# EAGLE design AnyFC_Final (EAGLE 6.5.0)
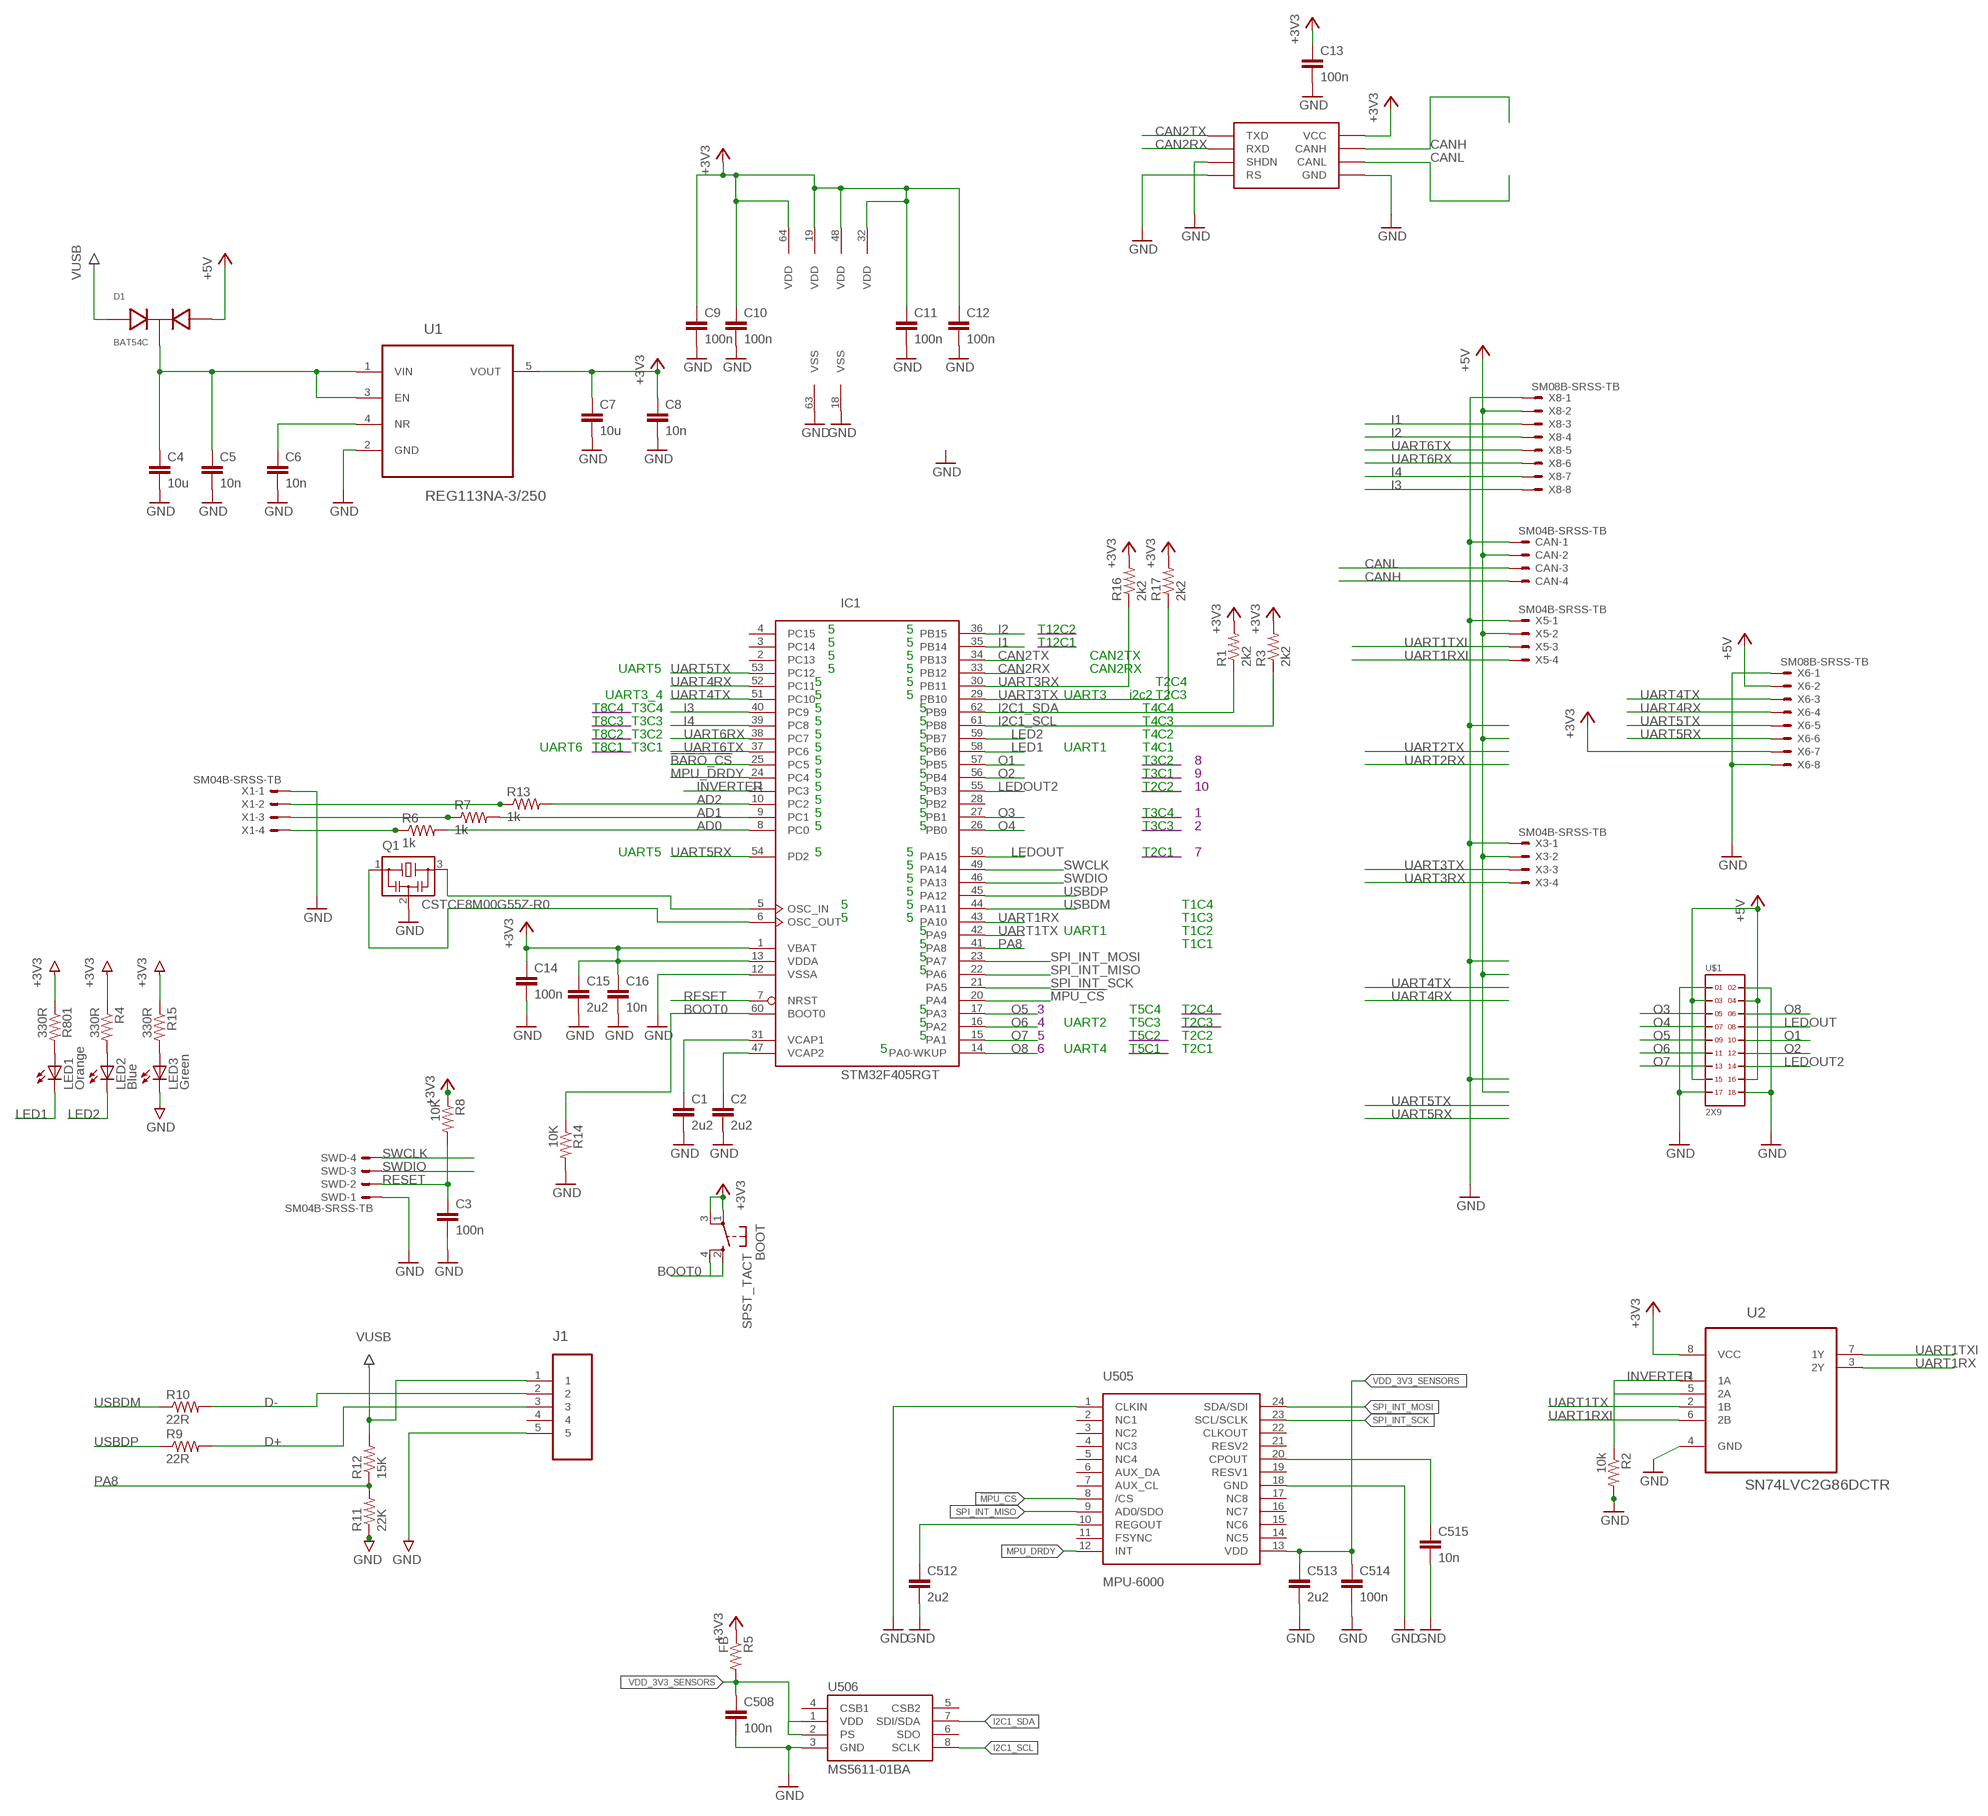
[diagram p0: schematic, sheet 1]

## Parts
BOOT  SPST_TACT  [EVQ-PU]
C1  2u2  CAP0603  [0603-CAP]
C2  2u2  CAP0603  [0603-CAP]
C3  100n  CAP0402  [0402-CAP]
C4  10u  CAP0805  [0805-CAP]
C5  10n  CAP0402  [0402-CAP]
C6  10n  CAP0402  [0402-CAP]
C7  10u  CAP0805  [0805-CAP]
C8  10n  CAP0402  [0402-CAP]
C9  100n  CAP0402  [0402-CAP]
C10  100n  CAP0402  [0402-CAP]
C11  100n  CAP0402  [0402-CAP]
C12  100n  CAP0402  [0402-CAP]
C13  100n  CAP0402  [0402-CAP]
C14  100n  CAP0402  [0402-CAP]
C15  2u2  CAP0603  [0603-CAP]
C16  10n  CAP0402  [0402-CAP]
C508  100n  CAP0402  [0402-CAP]
C512  2u2  CAP0603  [0603-CAP]
C513  2u2  CAP0603  [0603-CAP]
C514  100n  CAP0402  [0402-CAP]
C515  10n  CAP0402  [0402-CAP]
CAN  SM04B-SRSS-TB  [SM04B-SRSS-TB]
D1  BAT54C  [SOT23]
IC1  STM32F405RGT  [LQFP64]
J1  47346-0001  [MOLEX_47346-0001]
LED1  Orange  LEDCHIPLED_0603  [CHIPLED_0603]
LED2  Blue  LEDCHIPLED_0603  [CHIPLED_0603]
LED3  Green  LEDCHIPLED_0603  [CHIPLED_0603]
Q1  CSTCE8M00G55Z-R0  CSTCR6M00G53Z  [CSTER12M]
R1  2k2  RESISTOR0402-RES  [0402-RES]
R2  10k  RESISTOR0402-RES  [0402-RES]
R3  2k2  RESISTOR0402-RES  [0402-RES]
R4  330R  RESISTOR0402-RES  [0402-RES]
R5  FB  RESISTOR0603-RES  [0603-RES]
R6  1k  RESISTOR0402-RES  [0402-RES]
R7  1k  RESISTOR0402-RES  [0402-RES]
R8  10K  RESISTOR0402-RES  [0402-RES]
R9  22R  RESISTOR0402-RES  [0402-RES]
R10  22R  RESISTOR0402-RES  [0402-RES]
R11  22K  RESISTOR0402-RES  [0402-RES]
R12  15K  RESISTOR0402-RES  [0402-RES]
R13  1k  RESISTOR0402-RES  [0402-RES]
R14  10K  RESISTOR0402-RES  [0402-RES]
R15  330R  RESISTOR0402-RES  [0402-RES]
R16  2k2  RESISTOR0402-RES  [0402-RES]
R17  2k2  RESISTOR0402-RES  [0402-RES]
R801  330R  RESISTOR0402-RES  [0402-RES]
SWD  SM04B-SRSS-TB  [SM04B-SRSS-TB]
U1  REG113NA-3/250  [SOT95P280X145-5N]
U2  SN74LVC2G86DCTR  [SOP65P400X130-8N]
U3  MAX3051EKA  [SOT23-8L]
U505  MPU-6000  [QFN-24]
U506  MS5611-01BA  [MS5611-01BA]
U$1  2X9  [2X9]
X1  SM04B-SRSS-TB  [SM04B-SRSS-TB]
X3  SM04B-SRSS-TB  [SM04B-SRSS-TB]
X5  SM04B-SRSS-TB  [SM04B-SRSS-TB]
X6  SM08B-SRSS-TB  [SM08B-SRSS-TB]
X8  SM08B-SRSS-TB  [SM08B-SRSS-TB]

## Nets
!BARO_CS: IC1.25(PC5)
!MPU_CS: IC1.20(PA4) U505.8(/CS)
+3V3: BOOT.1(P) BOOT.3(P1) C7.P$1 C8.P$1 C9.P$1 C10.P$1 C11.P$1 C12.P$1 C13.P$1 C14.P$1 C15.P$1 C16.P$1 IC1.1(VBAT) IC1.13(VDDA) IC1.19(VDD) IC1.32(VDD) IC1.48(VDD) IC1.64(VDD) R1.P$2 R3.P$2 R4.P$1 R5.1 R8.P$1 R15.P$1 R16.P$2 R17.P$2 R801.P$1 U1.5(VOUT) U2.8(VCC) U3.3(VCC) X6.7
+5V: CAN.2 D1.2 U$1.3 U$1.4 U$1.15 U$1.16 X3.2 X5.2 X6.2 X8.2
AD0: IC1.8(PC0) R6.P$2
AD1: IC1.9(PC1) R7.P$2
AD2: IC1.10(PC2) R13.P$2
BOOT0: BOOT.2(S) BOOT.4(S1) IC1.60(BOOT0) R14.P$1
CAN2RX: IC1.33(PB12) U3.4(RXD)
CAN2TX: IC1.34(PB13) U3.1(TXD)
CANH: CAN.4 U3.7(CANH)
CANL: CAN.3 U3.6(CANL)
D+: J1.3 R9.P$2
D-: J1.2 R10.P$2
GND [power]: C1.P$2 C2.P$2 C3.P$2 C4.P$2 C5.P$2 C6.P$2 C7.P$2 C8.P$2 C9.P$2 C10.P$2 C11.P$2 C12.P$2 C13.P$2 C14.P$2 C15.P$2 C16.P$2 C508.P$2 C512.P$2 C513.P$2 C514.P$2 C515.P$2 CAN.1 IC1.12(VSSA) IC1.18(VSS) IC1.63(VSS) J1.5 LED3.C Q1.2 R2.P$2 R11.P$1 R14.P$2 SWD.1 U1.2(GND) U2.4(GND) U3.2(GND) U3.5(SHDN) U3.8(RS) U505.1(CLKIN) U505.18(GND) U506.3(GND) U$1.1 U$1.2 U$1.17 U$1.18 X1.1 X3.1 X5.1 X6.1 X6.8 X8.1
I1: IC1.35(PB14) X8.3
I2: IC1.36(PB15) X8.4
I2C1_SCL: IC1.61(PB8) R3.P$1 U506.8(SCLK)
I2C1_SDA: IC1.62(PB9) R1.P$1 U506.7(SDI/SDA)
I3: IC1.40(PC9) X8.8
I4: IC1.39(PC8) X8.7
INVERTER: IC1.11(PC3) R2.P$1 U2.1(1A) U2.5(2A)
LED1: IC1.58(PB6) LED1.C
LED2: IC1.59(PB7) LED2.C
LEDOUT: IC1.50(PA15) U$1.8
LEDOUT2: IC1.55(PB3) U$1.14
MPU_DRDY [power]: IC1.24(PC4) U505.12(INT)
N$1: C6.P$1 U1.4(NR)
N$2: IC1.5(OSC_IN) Q1.3
N$3: C1.P$1 IC1.31(VCAP1)
N$4: C2.P$1 IC1.47(VCAP2)
N$5: IC1.6(OSC_OUT) Q1.1
N$6: LED1.A R801.P$2
N$7: LED3.A R15.P$2
N$8: LED2.A R4.P$2
N$15: R6.P$1 X1.4
N$16: R7.P$1 X1.3
N$17: R13.P$1 X1.2
N$50: C512.P$1 U505.10(REGOUT)
N$51: C515.P$1 U505.20(CPOUT)
O1: IC1.57(PB5) U$1.10
O2: IC1.56(PB4) U$1.12
O3: IC1.27(PB1) U$1.5
O4: IC1.26(PB0) U$1.7
O5: IC1.17(PA3) U$1.9
O6: IC1.16(PA2) U$1.11
O7: IC1.15(PA1) U$1.13
O8: IC1.14(PA0-WKUP) U$1.6
PA8: IC1.41(PA8) R11.P$2 R12.P$1
RESET: C3.P$1 IC1.7(NRST) R8.P$2 SWD.2
SPI_INT_MISO: IC1.22(PA6) U505.9(AD0/SDO)
SPI_INT_MOSI: IC1.23(PA7) U505.24(SDA/SDI)
SPI_INT_SCK: IC1.21(PA5) U505.23(SCL/SCLK)
SWCLK: IC1.49(PA14) SWD.4
SWDIO: IC1.46(PA13) SWD.3
UART1RX: IC1.43(PA10) U2.3(2Y)
UART1RXI: U2.6(2B) X5.4
UART1TX: IC1.42(PA9) U2.2(1B)
UART1TXI: U2.7(1Y) X5.3
UART3RX: IC1.30(PB11) R16.P$1 X3.4
UART3TX: IC1.29(PB10) R17.P$1 X3.3
UART4RX: IC1.52(PC11) X6.4
UART4TX: IC1.51(PC10) X6.3
UART5RX: IC1.54(PD2) X6.6
UART5TX: IC1.53(PC12) X6.5
UART6RX: IC1.38(PC7) X8.6
UART6TX: IC1.37(PC6) X8.5
USBDM: IC1.44(PA11) R10.P$1
USBDP: IC1.45(PA12) R9.P$1
V5: C4.P$1 C5.P$1 D1.3 U1.1(VIN) U1.3(EN)
VDD_3V3_SENSORS [power]: C508.P$1 C513.P$1 C514.P$1 R5.2 U505.13(VDD) U506.1(VDD) U506.2(PS)
VUSB: D1.1 J1.1 R12.P$2
Unconnected: IC1.2(PC13) IC1.3(PC14) IC1.4(PC15) IC1.28(PB2) J1.4 U505.2(NC1) U505.3(NC2) U505.4(NC3) U505.5(NC4) U505.6(AUX_DA) U505.7(AUX_CL) U505.11(FSYNC) U505.14(NC5) U505.15(NC6) U505.16(NC7) U505.17(NC8) U505.19(RESV1) U505.21(RESV2) U505.22(CLKOUT) U506.4(CSB1) U506.5(CSB2) U506.6(SDO)

## Notes on the sheet
- 5 | 5 | T12C2
- 5 | 5 | T12C1
- 5 | 5 | CAN2TX
- UART5 | 5 | 5 | CAN2RX
- 5 | 5 | T2C4
- UART3_4 | 5 | 5 | UART3 | i2c2 | T2C3
- T8C4 | T3C4 | 5 | 5 | T4C4
- T8C3 | T3C3 | 5 | 5 | T4C3
- T8C2 | T3C2 | 5 | 5 | T4C2
- UART6 | T8C1 | T3C1 | 5 | 5 | UART1 | T4C1
- 5 | 5 | T3C2 | 8
- 5 | 5 | T3C1 | 9
- 5 | 5 | T2C2 | 10
- 5 | 5
- 5 | 5 | T3C4 | 1
- 5 | 5 | T3C3 | 2
- UART5 | 5 | 5 | T2C1 | 7
- 5
- 5
- 5
- 5 | 5 | T1C4
- 5 | 5 | T1C3
- 5 | UART1 | T1C2
- 5 | T1C1
- 5
- 5
- 5 | 3 | T5C4 | T2C4
- 5 | 4 | UART2 | T5C3 | T2C3
- 5 | 5 | T5C2 | T2C2
- 5 | 6 | UART4 | T5C1 | T2C1

## Library data of the parts
BOOT = omat:SPST_TACT: SMT 6mm switch, EVQQ2 series http://www.ladyada.net/library/eagle
C1-C16 C512 C513 = pixhawk2:CAP: Capacitor Standard 0603 ceramic capacitor, and 0.1" leaded capacitor.; PARTNO: C1608X6S1C225K080AC
C508 C514 = pixhawk2:CAP: Capacitor Standard 0603 ceramic capacitor, and 0.1" leaded capacitor.; PARTNO: CC0402ZRY5V7BB104
C515 = pixhawk2:CAP: Capacitor Standard 0603 ceramic capacitor, and 0.1" leaded capacitor.; PARTNO: 06033C103JAT2A
CAN SWD X1 X3 X5 = con-jst2:?M04B-SRSS-TB: Disconnectable Crimp style connector, 1.0mm pitch 4 contacts
D1 = zik:BAT54C: Dual schottky diode
IC1 = micro-stm_v2:STM32F405R*T: ARM 32-bit Cortex™-M3 CPU 168 MHz maximum frequency 1024 Kbytes of Flash memory 192 kbytes of SRAM 51 GPIOs 1.8 to 3.6 V application supply
J1 = Molex-47346-0001:47346-0001: CONN RCPT 5POS MICRO USB R/A SMD; MPN: 47346-0001; OC_FARNELL: 1568026; OC_NEWARK: 47M0505; PACKAGE: 5 POS MICRO USB R/A; SUPPLIER: MOLEX
LED1-LED3 = led:LED: LED OSRAM: - CHIPLED LG R971, LG N971, LY N971, LG Q971, LY Q971, LO R971, LY R971 LH N974, LH R974 LS Q976, LO Q976, LY Q976 LO Q996 - Hyper CHIPLED LW Q18S LB Q993, LB Q99A, LB R99A - SideLED LS A670, LO A670, LY A670, LG A670, LP A670 LB A673, LV A673, LT A673, LW A673 LH A674 LY A675 LS A676, LA A676, LO A676, LY A676, LW A676 LS A679, LY A679, LG A679 - Hyper Micro SIDELED® LS Y876, LA Y876, LO Y876, LY Y876 LT Y87S - SmartLED LW L88C, LW L88S LB L89C, LB L89S, LG L890 LS L89K, LO L89K, LY L89K LS L896, LA L896, LO L896, LY L896 - TOPLED LS T670, LO T670, LY T670, LG T670, LP T670 LSG T670, LSP T670, LSY T670, LOP T670, LYG T670 LG T671, LOG T671, LSG T671 LB T673, LV T673, LT T673, LW T673 LH T674 LS T676, LA T676, LO T676, LY T676, LB T676, LH T676, LSB T676, LW T676 LB T67C, LV T67C, LT T67C, LS T67K, LO T67K, LY T67K, LW E67C LS E67B, LA E67B, LO E67B, LY E67B, LB E67C, LV E67C, LT E67C LW T67C LS T679, LY T679, LG T679 LS T770, LO T770, LY T770, LG T770, LP T770 LB T773, LV T773, LT T773, LW T773 LH T774 LS E675, LA E675, LY E675, LS T675 LS T776, LA T776, LO T776, LY T776, LB T776 LHGB T686 LT T68C, LB T68C - Hyper Mini TOPLED® LB M676 - Mini TOPLED Santana® LG M470 LS M47K, LO M47K, LY M47K Source: http://www.osram.convergy.de LUXEON: - LUMILED® LXK2-PW12-R00, LXK2-PW12-S00, LXK2-PW14-U00, LXK2-PW14-V00 LXK2-PM12-R00, LXK2-PM12-S00, LXK2-PM14-U00 LXK2-PE12-Q00, LXK2-PE12-R00, LXK2-PE12-S00, LXK2-PE14-T00, LXK2-PE14-U00 LXK2-PB12-K00, LXK2-PB12-L00, LXK2-PB12-M00, LXK2-PB14-N00, LXK2-PB14-P00, LXK2-PB14-Q00 LXK2-PR12-L00, LXK2-PR12-M00, LXK2-PR14-Q00, LXK2-PR14-R00 LXK2-PD12-Q00, LXK2-PD12-R00, LXK2-PD12-S00 LXK2-PH12-R00, LXK2-PH12-S00 LXK2-PL12-P00, LXK2-PL12-Q00, LXK2-PL12-R00 Source: www.luxeon.com KINGBRIGHT: KA-3528ASYC Source: www.kingbright.com
Q1 = cstce-resonator:CSTCR: Resonator Source: murata.co.jp; MPN: CSTCC12M0; OC_FARNELL: 1170434; OC_NEWARK: 25M8759
R1-R17 R801 = pixhawk2:RESISTOR: Resistor Basic schematic elements and footprints for 0603, 1206, and PTH 1/10th watt (small) resistors.; PARTNO: RC0402FR-0710KL
U1 = REG113NA:REG113NA-3/250: DMOS 400mA Low-Dropout Regulator; MPN: REG113NA-3/250; OC_FARNELL: 1575540; OC_NEWARK: 75C7591; PACKAGE: SOT-23-5; SUPPLIER: Texas Instruments
U2 = SN74LVC2G86DCTR:SN74LVC2G86DCTR: DUAL 2-INPUT EXCLUSIVE-OR GATE,SSOP-8; MPN: SN74LVC2G86DCTR; OC_FARNELL: 2334919; OC_NEWARK: 94T5059; PACKAGE: SSOP-8; SUPPLIER: TEXAS INSTRUMENTS
U3 = maxim:MAX3051
U505 = pixhawk2:MPU-6000: Invensense MPU-6000: 3-axis gyro, 3-axis accel & 9-axis MotionFusion The MPU-60X0 Motion Processing Unit (MPU?) is the world?s first motion processing solution with integrated 9-axis sensor fusion for handset and tablet applications, game controllers, motion pointer remote controls, and other consumer devices. The MPU-60X0 has an embedded 3-axis MEMS gyroscope, 3-axis MEMS accelerometer and Digital Motion Processor? (DMP) hardware accelerator engine with an auxiliary I 2 C port that interfaces to third party digital sensors, such as magnetometers. Interfacing with a 3-axis magnetometer delivers a complete 9-axis sensor fusion output to the MPU?s primary I 2 C or SPI port. (SPI is available on MPU-6000 only). This combines acceleration and rotational motion plus heading information into a single data stream for the application; DATASHEET: http://invensense.com/mems/gyro/documents/PS-MPU-6000A-00_v1.0.pdf; LINK: http://invensense.com/mems/gyro/mpu6000.html; MFGPN: MPU-6000; PARTNO: MPU-6000
U506 = pixhawk2:MS5611-01BA: MS5611-01BA The MS5611-01BA is a new generation of high resolution altimeter sensors from MEAS Switzerland with SPI and I 2 C bus interface. It is optimized for altimeters and variometers with an altitude resolution of 10 cm. The sensor module includes a high linearity pressure sensor and an ultra low power 24 bit ?? ADC with internal factory calibrated coefficients. It provides a precise digital 24 Bit pressure and temperature value and different operation modes that allow the user to optimize for conversion speed and current consumption. A high resolution temperature output allows the implementation of an altimeter/thermometer function without any additional sensor. The MS5611-01BA can be interfaced to virtually any microcontroller. The communication protocol is simple, without the need of programming internal registers in the device. Small dimensions of only 5.0 mm x 3.0 mm and a height of 1.7 mm allow for integration in mobile devices. This new sensor module generation is based on leading MEMS technology and latest benefits from MEAS Switzerland proven experience and know-how in high volume manufacturing of altimeter modules, which have been widely used for over a decade. The sensing principle employed leads to very low hysteresis and high stability of both pressure and temperature signal. High resolution module, 10 cm Fast conversion down to 1 ms Low power, 1 µA (standby < 0.15 µA) QFN package 5.0 x 3.0 x 1.7 mm3 Supply voltage 1.8 to 3.6 V Integrated digital pressure sensor (24 bit ?? ADC) Operating range: 10 to 1200 mbar, -40 to +85 °C I2C and SPI interface up to 20 MHz No external components (Internal oscillator) Excellent long term stability; DATASHEET: http://www.meas-spec.com/downloads/MS5611-01BA01.pdf; LINK: http://www.meas-spec.com/product/t_product.aspx?id=8503#; MFGPN: MS5611-01BA; PARTNO: MS5611-01BA
U$1 = headers.edge(.1in):2X9
X6 X8 = con-jst2:?M08B-SRSS-TB: Disconnectable Crimp style connector, 1.0mm pitch 8 contacts

## Net classes
1 power: width 0.15 mm, drill 0.2 mm, clearance 0.152 mm

## Board
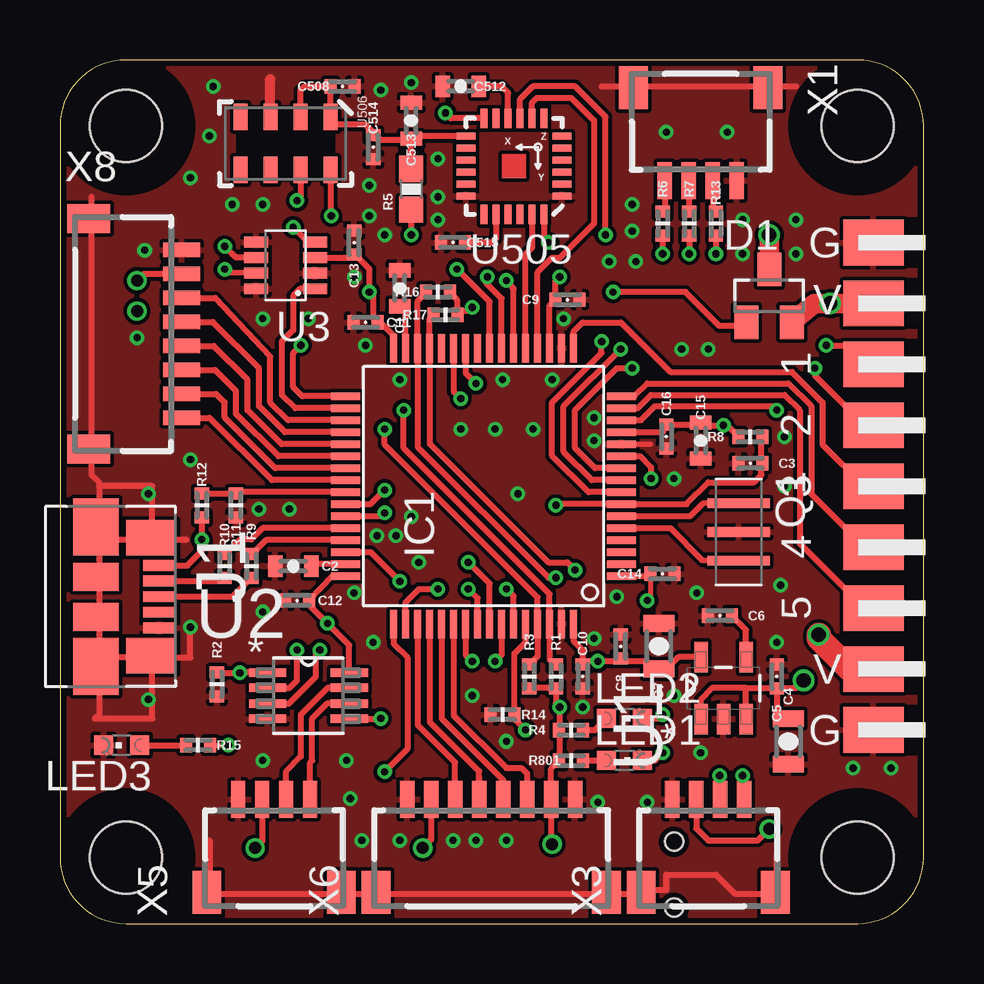
[diagram p1: board, top side]
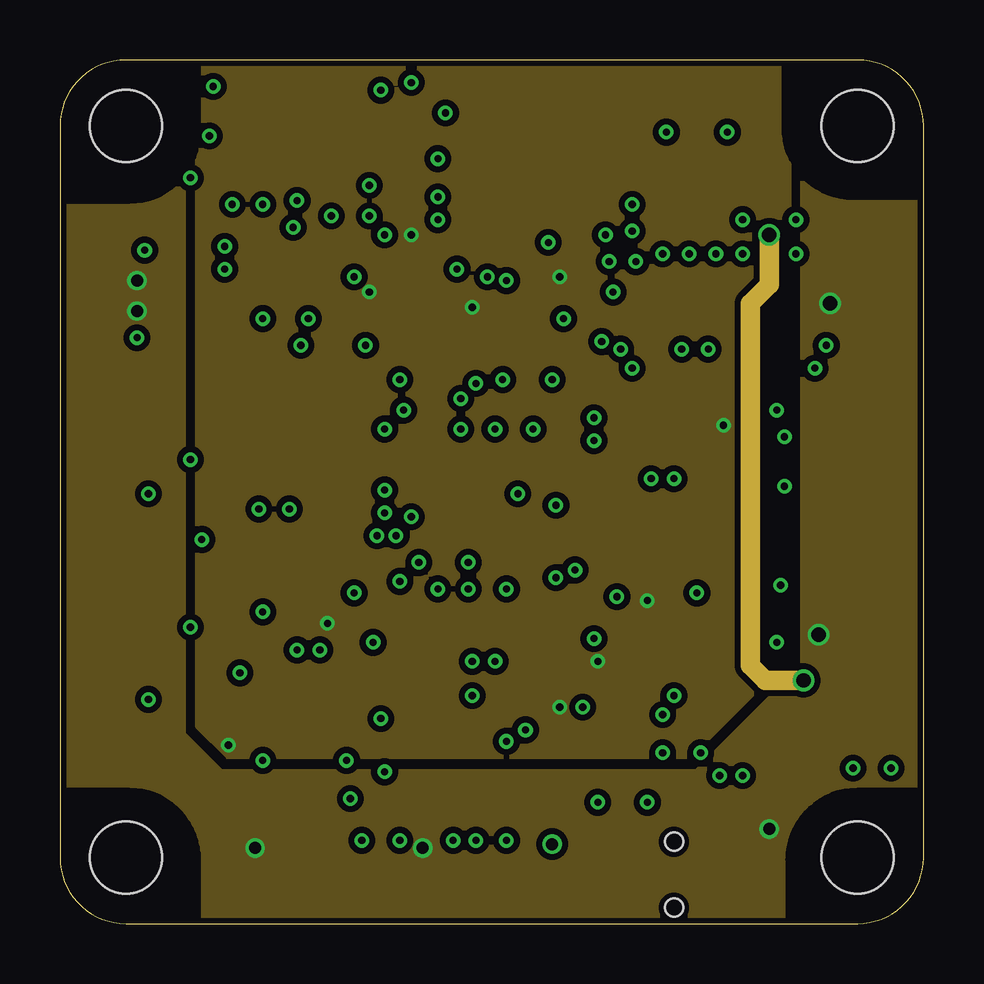
[diagram p2: board, inner layer Route2]
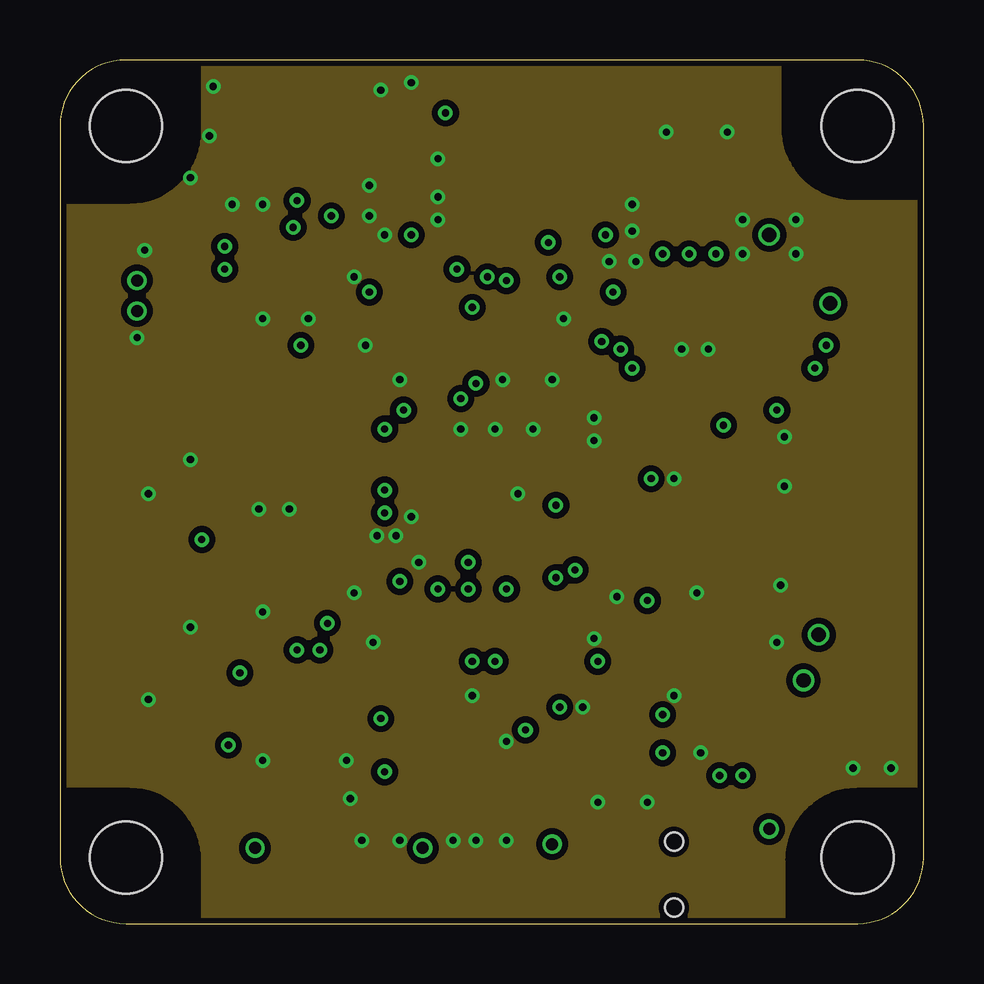
[diagram p3: board, inner layer Route15]
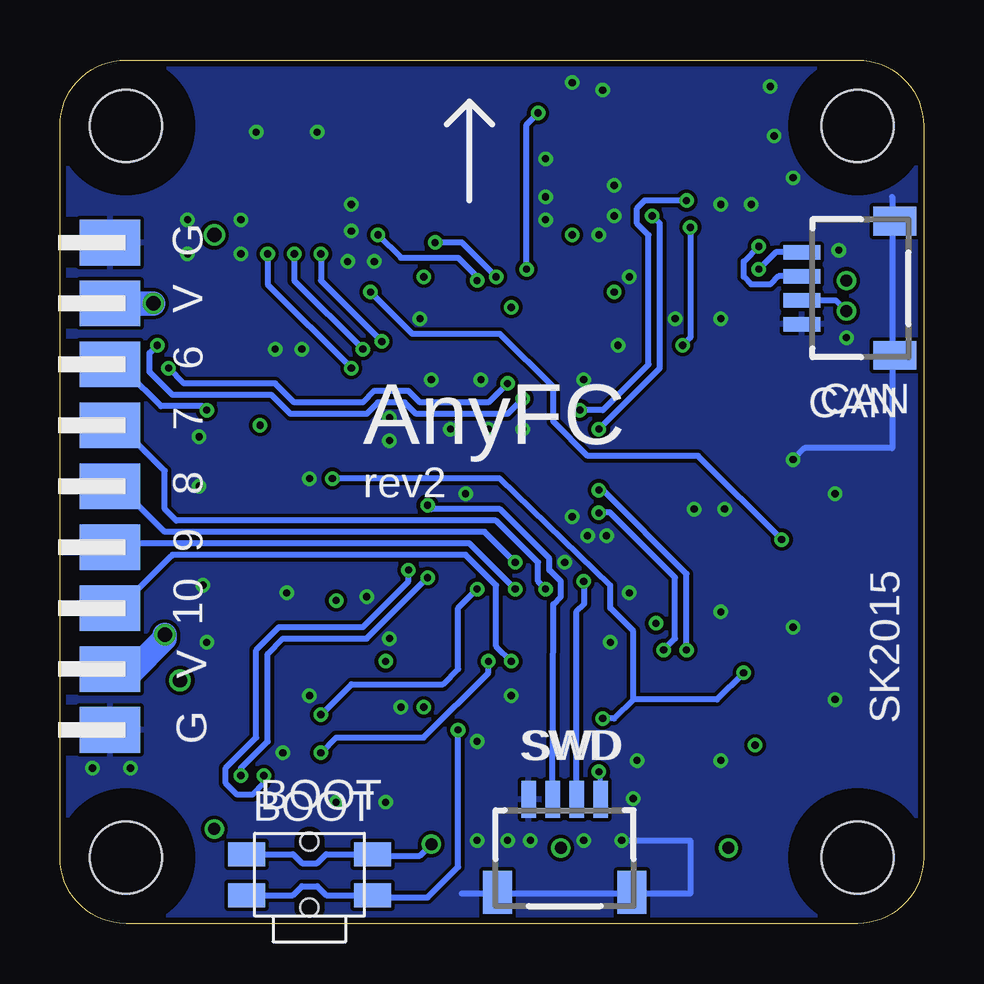
[diagram p4: board, bottom side, seen from below]

Size 36 x 36 mm. Coordinates in mm from the lower left corner, seen from the top.
Outline: 0,2.75 arc90 2.75,0 33.25,0 arc90 36,2.75 36,33.25 arc90 33.25,36 2.75,36 arc90 0,33.25 0,2.75
Copper layers (1*2*15*16): Top 0.035mm / dielectric 0.2mm / Route2 0.0175mm / dielectric 1.1mm / Route15 0.0175mm / dielectric 0.2mm / Bottom 0.035mm
Design rules "SeeedStudio_DRU_no_angle_20130527 *": minimum track width 6mil, minimum drill 10mil, track to track 6mil, track to pad 6mil, pad to pad 6mil, via to via 6mil, smd to smd 0mil, copper to edge 10mil, drill to drill 10mil, minimum pad ring 6mil, minimum via ring 6mil, stop-mask expansion 2mil, vias tented up to drill 25mil, thermal gap 6mil
Holes 3 mm at 2.75,2.75 2.75,33.25 33.25,33.25 33.25,2.75
tRestrict: area 0,0 to 5.5,5.5; area 30.5,0 to 36,5.5; area 30.5,30.5 to 36,36; area 0,30.5 to 5.5,36; area 7.3,30.9 to 11.5,34.1
bRestrict: area 0,30.5 to 5.5,36; area 30.5,30.5 to 36,36; area 30.5,0 to 36,5.5; area 0,0 to 5.5,5.5

### Footprints (pad centres in the part's own frame; a part is rotated, then mirrored left to right if it is on the bottom)
EVQ-PU = smd 1.55 x 1: 1 2.625,0.85; 2 2.625,-0.85; 3 -2.625,0.85; 4 -2.625,-0.85 | hole 0.75: 0,-1.375; 0,1.375
0603-CAP = smd 0.6 x 0.9: P$1 -0.75,0; P$2 0.75,0
0402-CAP = smd 0.5 x 0.6: P$1 -0.5,0; P$2 0.5,0
0805-CAP = smd 0.7 x 1.3: P$1 -0.95,0; P$2 0.95,0
SM04B-SRSS-TB = smd 0.6 x 1.55: 1 -1.5,2.975; 2 -0.5,2.975; 3 0.5,2.975; 4 1.5,2.975 | smd 1.2 x 1.8: FIT@1 -2.8,-0.9; FIT@2 2.8,-0.9
SOT23 = smd 1 x 1.4: 1 -0.95,-1.1; 2 0.95,-1.1; 3 0,1.1
LQFP64 = smd 0.3 x 1.2: 1 -3.75,-5.75; 2 -3.25,-5.75; 3 -2.75,-5.75; 4 -2.25,-5.75; 5 -1.75,-5.75; 6 -1.25,-5.75; 7 -0.75,-5.75; 8 -0.25,-5.75; 9 0.25,-5.75; 10 0.75,-5.75; 11 1.25,-5.75; 12 1.75,-5.75; 13 2.25,-5.75; 14 2.75,-5.75; 15 3.25,-5.75; 16 3.75,-5.75; 33 3.75,5.75; 34 3.25,5.75; 35 2.75,5.75; 36 2.25,5.75; 37 1.75,5.75; 38 1.25,5.75; 39 0.75,5.75; 40 0.25,5.75; 41 -0.25,5.75; 42 -0.75,5.75; 43 -1.25,5.75; 44 -1.75,5.75; 45 -2.25,5.75; 46 -2.75,5.75; 47 -3.25,5.75; 48 -3.75,5.75 | smd 1.2 x 0.3: 17 5.75,-3.75; 18 5.75,-3.25; 19 5.75,-2.75; 20 5.75,-2.25; 21 5.75,-1.75; 22 5.75,-1.25; 23 5.75,-0.75; 24 5.75,-0.25; 25 5.75,0.25; 26 5.75,0.75; 27 5.75,1.25; 28 5.75,1.75; 29 5.75,2.25; 30 5.75,2.75; 31 5.75,3.25; 32 5.75,3.75; 49 -5.75,3.75; 50 -5.75,3.25; 51 -5.75,2.75; 52 -5.75,2.25; 53 -5.75,1.75; 54 -5.75,1.25; 55 -5.75,0.75; 56 -5.75,0.25; 57 -5.75,-0.25; 58 -5.75,-0.75; 59 -5.75,-1.25; 60 -5.75,-1.75; 61 -5.75,-2.25; 62 -5.75,-2.75; 63 -5.75,-3.25; 64 -5.75,-3.75
MOLEX_47346-0001 = smd 0.45 x 1.38: 1 -1.3,0; 2 -0.65,0; 3 0,0; 4 0.65,0; 5 1.3,0 | smd 1.475 x 2.1: M1 -2.462,-0.36; M2 2.462,-0.36 | smd 2.375 x 1.9: M3 -2.913,-2.66; M6 2.913,-2.66 | smd 1.175 x 1.9: M4 -0.82,-2.66; M5 0.85,-2.66
CHIPLED_0603 = smd 0.8 x 0.8: A 0,-0.75; C 0,0.75
CSTER12M = smd 0.4 x 2.6: 1 -1.2,0; 2 0,0; 3 1.2,0
0402-RES = smd 0.5 x 0.6: P$1 -0.5,0; P$2 0.5,0
0603-RES = smd 1.1 x 1: 1 -0.85,0; 2 0.85,0
SOT95P280X145-5N = smd 1.27 x 0.559: 1 -1.295,0.94; 2 -1.295,0; 3 -1.295,-0.94; 4 1.295,-0.94; 5 1.295,0.94
SOP65P400X130-8N = smd 1.549 x 0.356: 1 -1.702,0.965; 2 -1.702,0.33; 3 -1.702,-0.33; 4 -1.702,-0.965; 5 1.702,-0.965; 6 1.702,-0.33; 7 1.702,0.33; 8 1.702,0.965
SOT23-8L = smd 0.45 x 1: 1 -0.975,-1.225; 2 -0.325,-1.225; 3 0.325,-1.225; 4 0.975,-1.225; 5 0.975,1.225; 6 0.325,1.225; 7 -0.325,1.225; 8 -0.975,1.225
QFN-24 = smd 0.8 x 0.29: 1 -2,1.25; 2 -2,0.75; 3 -2,0.25; 4 -2,-0.25; 5 -2,-0.75; 6 -2,-1.25; 13 2,-1.25; 14 2,-0.75; 15 2,-0.25; 16 2,0.25; 17 2,0.75; 18 2,1.25 | smd 0.29 x 0.8: 7 -1.25,-2; 8 -0.75,-2; 9 -0.25,-2; 10 0.25,-2; 11 0.75,-2; 12 1.25,-2; 19 1.25,2; 20 0.75,2; 21 0.25,2; 22 -0.25,2; 23 -0.75,2; 24 -1.25,2
MS5611-01BA = smd 1.1 x 0.6: 1 -1.1,1.875; 2 -1.1,0.625; 3 -1.1,-0.625; 4 -1.1,-1.875; 5 1.1,-1.875; 6 1.1,-0.625; 7 1.1,0.625; 8 1.1,1.875
2X9 = smd 1.905 x 2.54: 1 0,-2.159; 3 2.54,-2.159; 5 5.08,-2.159; 7 7.62,-2.159; 9 10.16,-2.159; 11 12.7,-2.159; 13 15.24,-2.159; 15 17.78,-2.159; 17 20.32,-2.159 | smd 1.905 x 2.54 bottom: 2 0,-2.159; 4 2.54,-2.159; 6 5.08,-2.159; 8 7.62,-2.159; 10 10.16,-2.159; 12 12.7,-2.159; 14 15.24,-2.159; 16 17.78,-2.159; 18 20.32,-2.159
SM08B-SRSS-TB = smd 0.6 x 1.55: 1 -3.5,2.975; 2 -2.5,2.975; 3 -1.5,2.975; 4 -0.5,2.975; 5 0.5,2.975; 6 1.5,2.975; 7 2.5,2.975; 8 3.5,2.975 | smd 1.2 x 1.8: FIT@1 -4.8,-0.9; FIT@2 4.8,-0.9

### Placement (x,y rotation side)
BOOT  25.6,2.04 0 bottom
C1  14.17,26.48 90 top
C2  9.72,14.9 180 top
C3  28.77,19.18 180 top
C4  30.36,7.59 270 top
C5  29.88,10.29 90 top
C6  27.5,12.83 180 top
C7  24.96,11.56 90 top
C8  23.38,11.56 90 top
C9  21.15,26.01 0 top
C10  21.79,10.29 270 top
C11  12.74,25.06 180 top
C12  9.88,13.47 180 top
C13  12.26,28.39 90 top
C14  25.12,14.58 0 top
C15  26.71,20.13 270 top
C16  25.28,20.29 270 top
C508  11.79,34.9 0 top
C512  16.71,34.9 180 top
C513  14.64,33.47 90 top
C514  13.06,32.36 270 top
C515  16.39,28.39 180 top
CAN  2.1,26.48 90 bottom
D1  29.57,26.17 0 top
IC1  17.66,18.23 90 top
J1  4.17,13.63 270 top
LED1  23.53,6.8 270 top
LED2  23.53,8.55 270 top
LED3  2.58,7.44 90 top
Q1  28.3,16.32 270 top
R1  20.68,10.29 270 top
R2  6.55,9.97 270 top
R3  19.56,10.29 270 top
R4  21.31,8.07 0 top
R5  14.64,30.61 90 top
R6  25.12,29.18 270 top
R7  26.23,29.18 270 top
R8  28.77,20.29 0 top
R9  7.98,14.9 270 top
R10  6.87,14.9 270 top
R11  7.34,17.44 90 top
R12  5.91,17.44 270 top
R13  27.34,29.18 270 top
R14  18.45,8.71 180 top
R15  5.75,7.44 180 top
R16  15.75,26.33 0 top
R17  16.07,25.37 0 top
R801  21.31,6.8 0 top
SWD  14.96,2.2 0 bottom
U1  27.66,9.82 90 top
U2  10.36,9.5 0 top
U3  9.4,27.44 90 top
U505  18.93,31.56 180 top
U506  9.4,32.52 270 top
U$1  36.08,28.39 270 top
X1  26.71,33.95 180 top
X3  27.03,2.2 0 top
X5  8.93,2.2 0 top
X6  17.98,2.2 0 top
X8  2.1,24.58 270 top

### Tracks (layer width: path | path; a pad name or v marks a point on that pad's centre or on a via)
!MPU_CS
  Top 0.254: IC1.20 19.91,27.15 20.52,27.75 20.84,27.75 22.26,29.18 22.26,33.47 21.31,34.42 19.88,34.42 19.68,34.22 U505.8
+3V3  (via drill 0.3, 0.5)
  Top 0.2: R15.P$1 v7.02,7.44 | 24.61,14.48 24.61,13.59 v24.49,13.47 | 10.36,13.49 C12.P$1
  Top 0.254: U3.3 12.25,27.76 12.26,27.91 | 12.26,27.91 12.27,27.77 C13.P$1 | IC1.13 25.12,20.48 C16.P$1 26.78,20.79 C15.P$1 26.75,20.88 26.39,20.93 26.71,20.93 26.71,20.77 v27.66,20.77 27.82,20.77 R8.P$1 | IC1.64 21.41,11.78 21.79,11.4 21.79,10.93 | 21.79,10.93 21.73,10.85 C10.P$1 21.79,10.93 | IC1.1 24.61,14.48 C14.P$1 | 26.71,10.61 U1.5 25.78,11.11 25.28,10.61 C7.P$1 25.1,10.58 24.8,10.61 | C7.P$1 24.8,10.61 | 24.8,10.61 24.49,10.92 24.48,10.92 23.38,10.93 | C8.P$1 23.38,10.93 | 23.38,10.93 v22.42,10.93 21.79,10.93 | IC1.48 11.37,14.48 10.86,13.97 C12.P$1 10.36,13.44 10.36,13.31 v11.15,12.52 12.06,11.61 U2.8 | IC1.32 13.91,24.52 13.37,25.06 13.29,24.97 13.27,24.97 C11.P$1 | IC1.19 20.41,25.77 C9.P$1 20.65,26.78 v20.84,26.96 | 20.79,8.98 v20.84,9.02 | R3.P$2 19.59,9.82 20.36,9.82 R1.P$2 20.68,9.18 v20.84,9.02 | v20.52,3.31 20.48,3.35 X6.7 20.48,6.44 20.84,6.8 | v20.84,9.02 20.84,8.23 20.81,8.25 R4.P$1 20.84,8.05 20.84,6.8 | 20.84,6.8 R801.P$1 | C11.P$1 13.06,25.21 13.06,26.17 v12.9,26.33 12.9,27.28 12.42,27.75 C13.P$1 | 13.19,25.06 C11.P$1 | 12.26,27.91 C13.P$1 | R5.1 v14.64,28.71 | R16.P$2 16.25,26.3 16.55,26.01 16.55,25.4 R17.P$2 16.73,25.53 17.18,25.53 v17.18,25.69
  Bottom 0.254: BOOT.3 26.29,2.89 25.91,2.51 25.28,2.51 24.91,2.89 BOOT.1 22.8,2.89 22.74,2.83 20.99,2.83 v20.52,3.31
  pour Route2 (isolate 0.254): 5.75,38.07 30.36,38.07 30.36,11.09 26.23,6.96 7.02,6.96 5.75,8.23
+5V  (via drill 0.5, 0.6)
  Top 0.254: X8.2 3.49,27.08 v3.21,26.8 | X5.2 8.43,3.44 v8.13,3.15 | X6.2 15.48,3.51 v15.12,3.15 | X3.2 26.53,3.97 27.03,3.47 29.09,3.47 v29.57,3.94
  Top 0.813: U$1.3 v32.11,25.85 31.46,25.85 D1.2
  Top 1.016: U$1.16 32.9,10.61 31.63,11.88 v31.63,12.04
  Bottom 0.254: CAN.2 3.67,25.98 v3.21,25.53
  Bottom 1.016: v31.63,12.04 31.63,11.88 33.06,10.45 U$1.16 | U$1.3 v32.11,25.85
  pour Route2 (isolate 0.254): 30.99,38.07 37.03,38.07 37.19,37.91 37.19,-2.41 36.71,-2.88 -2.82,-2.88 -3.93,-1.77 -3.93,37.76 -3.77,37.91 5.12,37.91 5.12,7.91 6.71,6.32 26.55,6.32 30.99,10.77
AD0  (via drill 0.3)
  Top 0.254: IC1.8 22.04,17.98 20.52,19.5 20.52,21.72 22.58,23.79 v22.58,24.26 | R6.P$2 v25.12,27.91
  Bottom 0.254: v25.12,27.91 25.12,26.8 v22.58,24.26
AD1  (via drill 0.3)
  Top 0.254: IC1.9 22.17,18.48 20.99,19.66 20.99,21.56 v23.38,23.95 | R7.P$2 v26.23,27.91
  Bottom 0.254: v26.23,27.91 26.23,26.8 v23.38,23.95
AD2  (via drill 0.3)
  Top 0.254: IC1.10 22.31,18.98 21.47,19.82 21.47,21.41 23.22,23.15 v23.85,23.15 | R13.P$2 v27.34,27.91
  Bottom 0.254: v27.34,27.91 27.34,26.64 v23.85,23.15
BOOT0  (via drill 0.3)
  Top 0.254: v19.41,8.07 18.95,8.52 R14.P$1 18.93,8.84 18.93,11.24 19.41,11.72 IC1.60
  Bottom 0.254: BOOT.4 26.29,1.19 25.91,1.56 25.28,1.56 24.91,1.19 BOOT.2 22.84,1.19 22.74,1.08 20.68,1.08 19.41,2.35 v19.41,8.07
CAN2RX  (via drill 0.3)
  Top 0.254: IC1.33 10.1,21.98 9.72,22.36 9.72,23.79 v10.04,24.1 | U3.4 10.33,28.41 v9.72,29.02
  Bottom 0.254: v9.72,29.02 9.72,24.42 v10.04,24.1
CAN2TX
  Top 0.254: U3.1 10.02,26.46 9.72,26.17 9.72,24.74 9.25,24.26 9.25,22.04 9.81,21.48 IC1.34
CANH  (via drill 0.3)
  Top 0.254: U3.7 7.02,27.13 v6.87,27.28
  Bottom 0.254: CAN.4 6.16,27.98 v6.87,27.28
CANL  (via drill 0.3)
  Top 0.254: U3.6 7.33,27.76 7.19,27.91 7.18,27.91 v6.87,28.23
  Bottom 0.254: CAN.3 6.05,26.98 6.39,26.64 7.18,26.64 7.5,26.96 7.5,27.6 v6.87,28.23
D+
  Top 0.254: J1.3 7.18,13.63 R9.P$2
D-
  Top 0.254: J1.2 6.75,14.28 R10.P$2
GND  (via drill 0.3)
  Top 0.2: IC1.12 24.62,19.98
  Top 0.254: 1.31,30.29 1.31,18.71 1.63,18.39 1.63,18.23 | 1.63,18.23 1.63,16.01 | 1.63,16.01 3.85,16.01 | 3.85,16.01 3.85,18.23 1.63,18.23 | 1.63,16.01 1.63,11.09 | 1.63,11.09 1.63,8.71 1.47,8.55 3.85,8.55 3.85,11.09 | 3.85,11.09 1.63,11.09 | 3.85,11.09 5.44,11.09 v5.44,12.36 | 6.23,3.47 6.23,1.24 24.49,1.24 24.64,1.4 25.28,1.4 25.28,2.04 27.34,2.04 28.14,1.24 29.88,1.24 29.88,2.83 | 3.85,16.01 5.28,16.01 | 22.58,34.9 30.68,34.9
  Top 0.406: 8.77,35.22 8.77,33.47 8.78,33.47 U506.3
  Bottom 0.254: 1.31,30.29 1.31,19.82 4.96,19.82 v5.44,19.34 | v12.58,3.47 9.72,3.47 9.72,1.24 19.25,1.24
  other vias: 25.6,18.55 18.14,20.61 14.64,16.96 8.45,12.99 9.56,17.28 12.9,29.5 7.18,29.98 25.28,32.99 14.64,35.06 13.37,34.74 5.44,31.09 14.01,16.17 19.09,17.91 23.22,13.63 30.04,14.1 12.26,26.96 8.45,25.21 14.17,22.68 12.74,24.1 13.53,28.71 15.75,29.34 6.39,34.9 6.23,32.84 15.75,31.88 15.75,30.29 12.9,30.77 8.45,29.98 22.9,27.6 24.01,27.6 23.85,28.87 23.85,29.98 28.45,29.34 28.45,27.91 30.68,27.91 30.68,29.34 34.65,6.48 33.06,6.48 17.18,9.5 18.61,7.59 18.61,3.47 16.39,3.47 17.34,3.47 14.17,3.47 22.26,11.88 13.21,16.17 12.26,13.79 19.72,20.61 16.71,20.61 20.99,25.21 21.79,9.02 24.49,5.05 22.42,5.05 12.1,5.21 26.71,7.12 25.6,9.5 30.2,20.29 30.2,18.23 14.96,15.05 22.26,21.09 22.26,20.13 26.55,13.79 29.88,11.72 10.36,25.21 3.53,28.07 3.21,24.42 3.69,17.91 3.69,9.34 11.95,6.8 8.45,6.8 8.29,17.28 27.82,32.99 25.91,23.95 27.03,23.95 18.45,22.68 20.52,22.68 13.06,11.72
  pour Top: -14.57,42.84 -14.57,-10.19 61,-10.19 61,42.84
  pour Bottom: -14.57,42.84 -14.57,-7.96 60.36,-7.96 60.36,42.84
  pour Route15 (isolate 0.254): -7.26,40.14 -7.26,-5.11 42.58,-5.11 42.58,40.14
I1
  Top 0.254: IC1.35 9.51,20.98 8.77,21.72 8.77,23.63 6.48,26.08 X8.3
I2
  Top 0.254: IC1.36 9.38,20.48 8.29,21.56 8.29,23.15 6.37,25.08 X8.4
I2C1_SCL  (via drill 0.3)
  Top 0.254: v13.53,20.61 13.53,19.98 19.91,13.6 IC1.61 19.91,11.14 R3.P$1 | U506.8 11.28,29.63 v11.31,29.5
  Bottom 0.254: v13.53,20.61 10.99,23.15 10.99,29.18 v11.31,29.5
I2C1_SDA  (via drill 0.3)
  Top 0.254: v14.33,21.41 14.33,19.82 20.41,13.73 IC1.62 20.41,11 R1.P$1 | U506.7 10.03,30.29 v9.88,30.14
  Bottom 0.254: v9.88,30.14 11.63,30.14 11.95,29.82 11.95,29.18 11.47,28.71 11.47,23.31 13.37,21.41 v14.33,21.41
I3
  Top 0.254: IC1.40 8.84,18.48 6.24,21.08 X8.8
I4
  Top 0.254: IC1.39 8.97,18.98 6.87,21.09 6.87,21.72 6.51,22.08 X8.7
INVERTER  (via drill 0.3)
  Top 0.254: U2.5 13.2,8.53 13.21,8.55 v13.37,8.55 | U2.1 7.51,10.46 v7.5,10.45 6.55,10.45 R2.P$1 | IC1.11 24.19,19.48 24.64,19.02 v24.64,18.55
  Bottom 0.254: v7.5,10.45 8.61,9.34 12.1,9.34 | 12.1,9.34 12.1,12.2 13.06,13.15 13.06,14.1 17.66,18.55 v24.64,18.55 | 12.1,9.34 12.9,8.55 v13.37,8.55
LED1  (via drill 0.3)
  Top 0.254: IC1.58 18.41,11.2 v18.14,10.93 | LED1.C 24.8,6.8 v25.12,7.12
  Bottom 0.254: v25.12,7.12 24.49,7.75 20.84,7.75 18.14,10.45 v18.14,10.93
LED2  (via drill 0.3)
  Top 0.254: IC1.59 18.91,13.65 v18.61,13.94 | LED2.C 24.96,8.55 v25.12,8.71
  Bottom 0.254: v25.12,8.71 23.85,9.97 20.04,9.97 19.41,10.61 19.41,13.15 v18.61,13.94
LEDOUT  (via drill 0.3)
  Top 0.254: IC1.50 14.41,13.39 14.96,13.94 v15.75,13.94
  Bottom 0.254: v15.75,13.94 16.07,14.26 16.07,15.05 17.82,16.8 31.15,16.8 31.63,17.28 31.63,18.86 33.53,20.77 U$1.8
LEDOUT2  (via drill 0.3)
  Top 0.254: IC1.55 16.91,11.2 v17.18,10.93 17.02,11.09
  Bottom 0.254: v17.18,10.93 17.82,11.56 17.82,14.1 19.09,15.37 31.31,15.37 31.47,15.21 33.69,12.99 U$1.14
MPU_DRDY  (via drill 0.3)
  Top 0.254: IC1.24 17.91,25.92 v16.55,27.28 | U505.12 16.29,33.56 v16.07,33.79
  Bottom 0.254: v16.55,27.28 16.55,33.31 v16.07,33.79
N$1
  Top 0.254: U1.4 28.6,12.23 C6.P$1
N$2
  Top 0.254: Q1.3 26.78,15.14 25.44,16.48 IC1.5
N$3
  Top 0.254: IC1.31 14.41,25.69 14.17,25.69 C1.P$1
N$4
  Top 0.254: IC1.47 10.48,14.98 C2.P$1
N$5
  Top 0.254: IC1.6 26.27,16.98 26.8,17.51 Q1.1
N$6
  Top 0.254: R801.P$2 LED1.A
N$7
  Top 0.254: LED3.A R15.P$2
N$8
  Top 0.254: R4.P$2 22.31,8.07 LED2.A
N$9
  cutout Route2 (isolate 0.254): 30.52,-0.66 36.39,-0.66 36.39,5.37 36.39,5.53 33.22,5.53 arc90 30.36,2.67 30.36,-0.5 arc90
  cutout Route15 (isolate 0.254): 30.52,-0.66 36.39,-0.66 36.39,5.37 36.39,5.53 33.22,5.53 arc90 30.36,2.67 30.36,-0.5 arc90
  cutout Route2 (isolate 0.254): 36.39,30.45 36.39,36.33 30.36,36.33 30.2,36.33 30.2,33.15 arc90 33.06,30.29 36.23,30.29 arc90
  cutout Route2 (isolate 0.254): 5.6,36.33 -0.28,36.33 -0.28,30.29 -0.28,30.14 2.9,30.14 arc90 5.75,32.99 5.75,36.17 arc90
  cutout Route2 (isolate 0.254): -0.44,5.37 -0.44,-0.5 5.6,-0.5 5.75,-0.5 5.75,2.67 arc90 2.9,5.53 -0.28,5.53 arc90
  cutout Route15 (isolate 0.254): -0.44,5.37 -0.44,-0.5 5.6,-0.5 5.75,-0.5 5.75,2.67 arc90 2.9,5.53 -0.28,5.53 arc90
  cutout Route15 (isolate 0.254): 5.6,36.33 -0.28,36.33 -0.28,30.29 -0.28,30.14 2.9,30.14 arc90 5.75,32.99 5.75,36.17 arc90
  cutout Route15 (isolate 0.254): 36.39,30.45 36.39,36.33 30.36,36.33 30.2,36.33 30.2,33.15 arc90 33.06,30.29 36.23,30.29 arc90
N$15
  Top 0.254: X1.4 25.21,29.77 R6.P$1
N$16
  Top 0.254: X1.3 26.21,29.71 R7.P$1
N$17
  Top 0.254: X1.2 27.21,29.82 R13.P$1
N$50
  Top 0.254: U505.10 18.68,34.63 18.41,34.9 C512.P$1
N$51
  Top 0.254: U505.20 18.18,28.57 18,28.39 C515.P$1
O1  (via drill 0.3)
  Top 0.254: IC1.57 17.91,14.17 v17.02,15.05
  Bottom 0.254: v17.02,15.05 18.29,16.32 31.63,16.32 33.38,18.07 34.17,18.23 U$1.10
O2  (via drill 0.3)
  Top 0.254: IC1.56 17.41,13.56 v17.02,13.94
  Bottom 0.254: v17.02,13.94 18.93,15.85 33.85,15.85 34.49,15.69 U$1.12
O3  (via drill 0.3)
  Top 0.254: v31.95,24.1 33.53,24.1 34.33,23.31 U$1.5 | IC1.27 16.41,22.18 v16.71,21.88
  Bottom 0.254: v16.71,21.88 17.34,21.25 21.15,21.25 21.63,21.72 22.74,21.72 23.22,21.25 26.39,21.25 27.18,22.04 31.31,22.04 32.27,22.99 32.27,23.79 v31.95,24.1
O4  (via drill 0.3)
  Top 0.254: v31.47,23.15 31.47,22.83 33.38,20.93 U$1.7 | IC1.26 16.91,22.95 v17.34,22.52
  Bottom 0.254: v17.34,22.52 18.14,21.72 20.99,21.72 21.47,22.2 22.9,22.2 23.38,21.72 26.23,21.72 27.03,22.52 30.84,22.52 v31.47,23.15
O5
  Top 0.254: IC1.17 21.41,24.68 21.79,25.06 23.38,25.06 25.44,22.99 30.52,22.99 31.79,21.72 31.79,19.98 33.53,18.23 U$1.9
O6
  Top 0.254: IC1.16 23.95,21.98 24.49,22.52 30.36,22.52 31.31,21.56 31.31,17.91 33.38,15.85 | 33.69,15.53 33.38,15.85 | 33.38,15.85 U$1.11
O7
  Top 0.254: IC1.15 24.09,21.48 24.64,22.04 30.2,22.04 30.84,21.41 30.84,15.85 33.53,13.15 U$1.13
O8  (via drill 0.3)
  Top 0.254: IC1.14 24.22,20.98 24.8,21.56 29.72,21.56 v29.88,21.41
  Bottom 0.254: v29.88,21.41 30.04,21.56 31.79,21.56 33.22,22.99 33.85,23.31 U$1.6
PA8
  Top 0.254: IC1.41 7.39,17.98 R11.P$2 7.34,17.91 5.94,17.91 R12.P$1
RESET  (via drill 0.3)
  Top 0.254: v20.68,17.44 20.72,17.48 IC1.7 26.12,17.48 27.03,18.39 28.93,18.39 29.25,18.71 29.25,19.18 | 29.24,20.27 29.24,20.29 29.25,20.29 R8.P$2 29.25,20.27 29.25,19.18 | C3.P$1 29.25,19.18
  Bottom 0.254: SWD.2 15.44,13.31 15.12,13.63 15.12,14.26 15.6,14.74 15.6,15.21 17.66,17.28 20.52,17.28 v20.68,17.44
SPI_INT_MISO  (via drill 0.3)
  Top 0.254: IC1.22 18.91,26.46 v18.61,26.8 | U505.9 19.18,34.35 19.72,34.9 21.47,34.9 22.74,33.63 v22.74,28.71
  Bottom 0.254: v22.74,28.71 21.79,27.75 19.41,27.75 18.61,26.96 v18.61,26.8
SPI_INT_MOSI  (via drill 0.3)
  Top 0.254: IC1.23 18.41,26.05 17.77,26.69 17.77,26.85 v17.82,26.96 | U505.24 20.18,28.57 v20.36,28.39
  Bottom 0.254: v17.82,26.96 19.25,28.39 v20.36,28.39
SPI_INT_SCK
  Top 0.254: IC1.21 19.41,27.91 19.56,28.07 19.68,28.19 U505.23
SWCLK  (via drill 0.3)
  Top 0.254: IC1.49 13.91,11.66 14.48,11.09 14.48,7.28 v13.53,6.32
  Bottom 0.2: SWD.4 13.46,6.25 v13.53,6.32
SWDIO  (via drill 0.3)
  Top 0.254: IC1.46 12.95,15.48 v14.17,14.26
  Bottom 0.254: SWD.3 14.46,13.02 14.14,13.33 14.14,14.24 v14.17,14.26
UART1RX  (via drill 0.3)
  Top 0.254: U2.3 9.55,9.17 10.67,10.29 10.67,11.24 v10.83,11.4 | IC1.43 13.39,16.98 v13.53,17.12
  Bottom 0.254: v10.83,11.4 10.36,11.88 10.36,14.42 13.08,17.14 13.53,17.14 13.51,17.12 v13.53,17.12
UART1RXI
  Top 0.254: X5.4 10.43,6.71 10.52,6.8 10.52,8.55 11.14,9.17 U2.6
UART1TX  (via drill 0.3)
  Top 0.254: U2.2 9.58,9.83 9.88,10.13 v9.88,11.4 | IC1.42 12.94,17.48 v13.53,18.07
  Bottom 0.254: v9.88,11.4 9.88,14.58 13.37,18.07 v13.53,18.07
UART1TXI
  Top 0.254: U2.7 11.16,9.83 10.04,8.71 10.04,6.96 9.43,6.35 X5.3
UART3RX  (via drill 0.3)
  Top 0.254: X3.4 28.53,6.09 v28.45,6.17 | v20.68,14.42 20.36,14.42 14.91,19.87 IC1.30 14.91,25.96 15.28,26.33 R16.P$1
  Bottom 0.254: v28.45,6.17 28.45,6.48 27.34,7.59 27.34,11.24 26.71,11.88 23.22,11.88 v20.68,14.42
UART3TX  (via drill 0.3)
  Top 0.254: X3.3 27.53,5.98 v27.5,6.17 | v21.47,14.74 21.15,15.05 20.36,15.05 15.41,20 IC1.29 15.41,25.21 R17.P$1
  Bottom 0.254: v27.5,6.17 27.5,5.85 27.98,5.37 28.61,5.37 29.09,5.85 29.09,6.48 27.82,7.75 27.82,11.4 26.87,12.36 23.38,12.36 21.47,14.26 v21.47,14.74
UART4RX
  Top 0.254: IC1.52 15.41,8.41 17.48,6.35 | 17.5,5.53 17.48,6.35 | X6.4 17.48,6.35
UART4TX
  Top 0.254: IC1.51 14.91,8.28 16.48,6.71 X6.3
UART5RX
  Top 0.254: IC1.54 16.41,8.69 18.61,6.48 19.25,6.48 19.48,6.25 X6.6
UART5TX
  Top 0.254: IC1.53 15.91,11.4 15.91,8.55 18.48,5.98 X6.5
UART6RX
  Top 0.254: IC1.38 9.11,19.48 7.34,21.25 7.34,22.2 6.46,23.08 X8.6
UART6TX
  Top 0.254: IC1.37 9.24,19.98 7.82,21.41 7.82,22.68 6.41,24.08 X8.5
USBDM
  Top 0.254: IC1.44 8.45,16.48 7.98,16.01 7.5,16.01 7.34,15.85 R10.P$1
USBDP
  Top 0.254: IC1.45 8.58,15.98 8,15.4 R9.P$1
V5  (via drill 0.6)
  Top 0.254: U1.1 26.72,9.35 27.18,9.82 28.61,9.82 | 28.61,9.82 29.88,9.82 | 29.88,9.82 29.88,8.55 | 29.88,8.55 C4.P$1 29.89,8.54 29.88,8.55 | U1.3 28.6,9.8 28.61,9.82 | C5.P$1 29.88,9.82 | 29.88,9.82 | 29.89,9.82 29.88,8.55 | 29.88,9.82 29.89,9.82 | 29.89,9.82 30.68,9.82 v30.99,10.13
  Top 0.813: D1.3 v29.57,28.71
  Route2 0.813: v30.99,10.13 29.41,10.13 28.77,10.77 28.77,25.85 29.57,26.64 v29.57,28.71
VDD_3V3_SENSORS
  Top 0.254: U506.2 10.03,34.73 10.2,34.9 C508.P$1 11.15,34.9 11.28,34.77 | U506.1 11.28,34.77 | U505.13 14.66,32.81 | 13.06,32.99 12.74,33.31 11.25,33.31 11.28,34.77 | 14.66,32.81 14.64,32.84 | C514.P$1 13.06,32.99 | 13.06,32.99 13.37,32.68 14.6,32.68 C513.P$1 | R5.2 C513.P$1 | C513.P$1 14.64,32.8 14.66,32.81
VUSB  (via drill 0.3)
  Top 0.254: J1.1 5.31,14.93 5.91,15.53 v5.91,16.01 R12.P$2 | D1.1 28.77,25.06 28.62,24.91 27.49,24.91 26.07,26.33 v23.06,26.33
  Bottom 0.254: v5.91,16.01 9.4,19.5 14.01,19.5 15.44,20.93 15.44,22.36 17.66,24.58 21.31,24.58 v23.06,26.33

### Text on the board
tPlace: G | V | 1 | 2 | 3 | 4 | 5 | V | G
bPlace: G | V | 6 | CAN | 7 | AnyFC | 8 | rev2 | 9 | SK2015 | 10 | V | G | SWD | BOOT